# Altium schematic sheet IIC.SchDoc
size A4; SheetNumber: 7
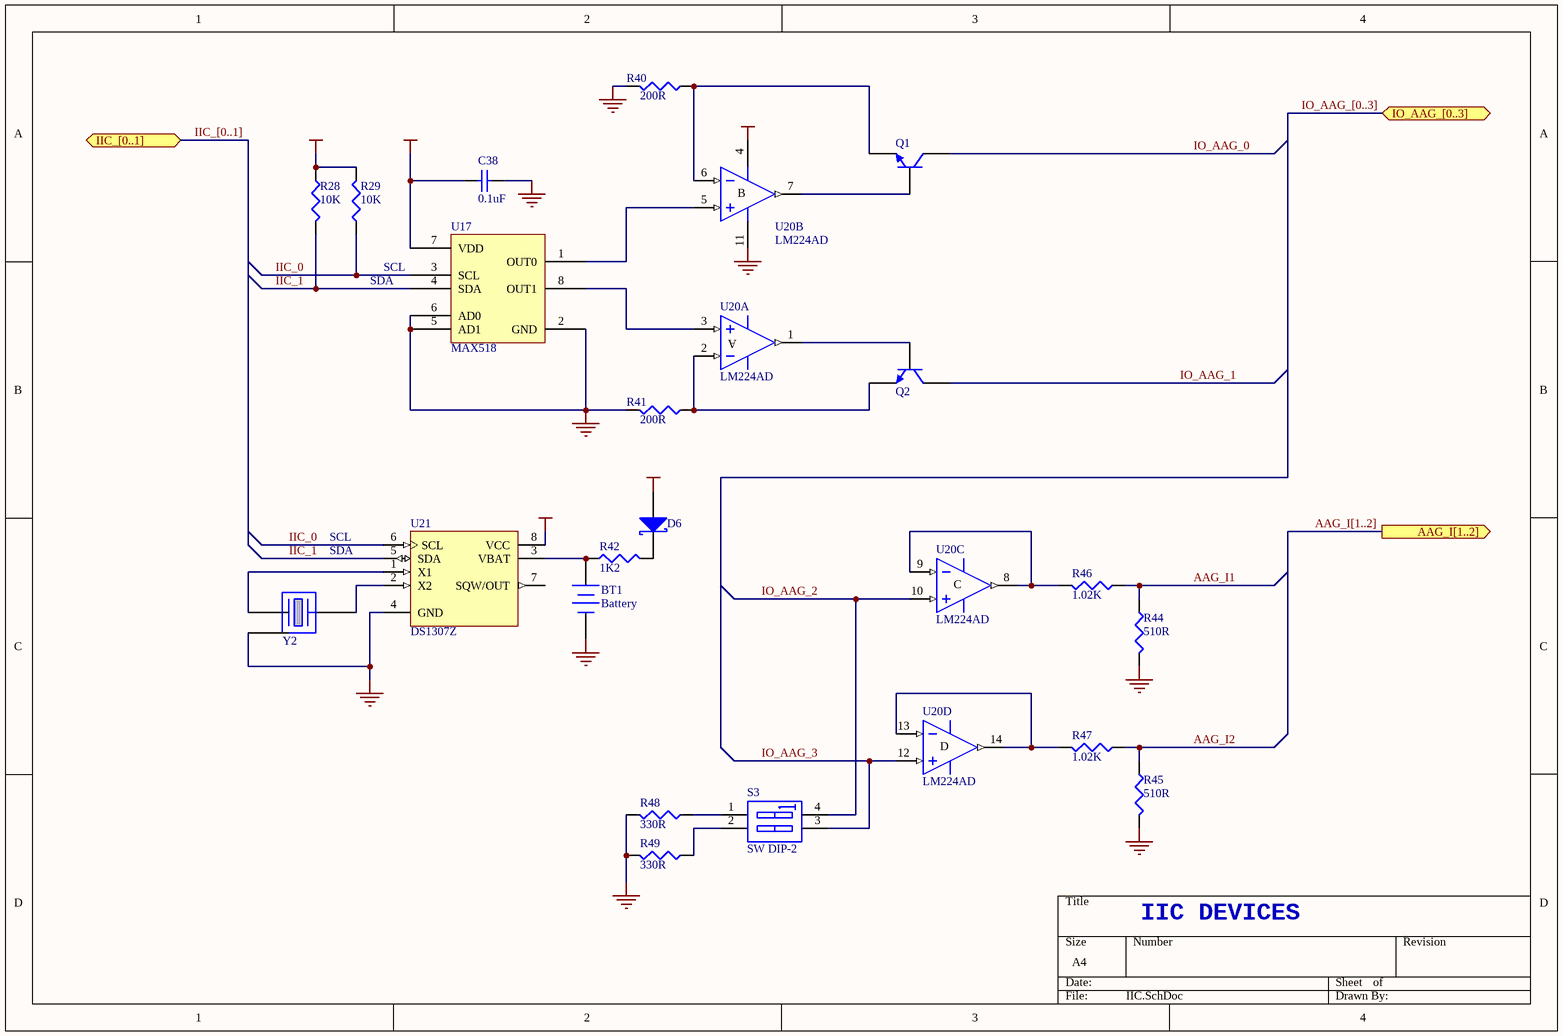
[diagram p0: IIC.SchDoc]

## Parts
BT1  Battery  [LITHIUM_BAT]
C38  value 0.1uF  [_0805]  (hidden comment: Cap Semi)
D6  Diode BAS70  [SO-G3/C2.5]  (value not drawn)
Q1  QNPN  [SO-G3/C2.5]  (value not drawn)
Q2  QNPN  [SO-G3/C2.5]  (value not drawn)
R28  value 10K  [_0805]  (hidden comment: Res3)
R29  value 10K  [_0805]  (hidden comment: Res3)
R40  value 200R  [_1206]  (hidden comment: Res3)
R41  value 200R  [_1206]  (hidden comment: Res3)
R42  value 1K2  [_0805]  (hidden comment: Res3)
R44  value 510R  [_0805]  (hidden comment: Res3)
R45  value 510R  [_0805]  (hidden comment: Res3)
R46  value 1.02K  [_0805]  (hidden comment: Res3)
R47  value 1.02K  [_0805]  (hidden comment: Res3)
R48  value 330R  [_0805]  (hidden comment: Res3)
R49  value 330R  [_0805]  (hidden comment: Res3)
S3  SW DIP-2  [SWITCH_2SPST]
U17  MAX518  [SO-G8/D5]
U20  LM224AD  [SO14B]  (parts A,B,C,D of 4)
U21  DS1307Z  [SOIC8N]
Y2  CRISTAL_SMD  [XTAL_32KHZ]  (value not drawn)

## Ports
AAG_I[1..2] (out), IIC_[0..1] (bidir), IO_AAG_[0..3] (bidir)

## Nets
GND: BT1.2(-) C38.2 R40.2 R41.2 R44.1 R45.1 R48.1 R49.1 U17.2(GND) U17.5(AD1) U17.6(AD0) U20.11(V-) U21.4(GND) Y2.0
VCC_3V: D6.1(A) R28.1 R29.2
VCC_5V: C38.1 U17.7(VDD) U21.8(VCC)
VCC_IN: U20.4(V+)
AAG_I1: R44.2 R46.2
AAG_I2: R45.2 R47.2
IIC_0: R29.1 U17.3(SCL) U21.6(SCL)
IIC_1: R28.2 U17.4(SDA) U21.5(SDA)
IO_AAG_0: Q1.3(C)
IO_AAG_1: Q2.3(C)
IO_AAG_2: S3.4(B1) U20.10(IN+)
IO_AAG_3: S3.3(B2) U20.12(IN+)
NetBT1_1: BT1.1(+) R42.1 U21.3(VBAT)
NetD6_3: D6.3(K) R42.2
NetQ1_1: Q1.1(B) U20.7(OUT)
NetQ1_2: Q1.2(E) R40.1 U20.6(IN-)
NetQ2_1: Q2.1(B) U20.1(OUT)
NetQ2_2: Q2.2(E) R41.1 U20.2(IN-)
NetR46_1: R46.1 U20.8(OUT) U20.9(IN-)
NetR47_1: R47.1 U20.13(IN-) U20.14(OUT)
NetR48_2: R48.2 S3.1(A1)
NetR49_2: R49.2 S3.2(A2)
NetU17_1: U17.1(OUT0) U20.5(IN+)
NetU17_8: U17.8(OUT1) U20.3(IN+)
NetU21_1: U21.1(X1) Y2.2
NetU21_2: U21.2(X2) Y2.1

Not connected (* = marked no-connect by the designer): U21 7(SQW/OUT)

## Buses and harness runs
bus AAG_I[1..2] = port AAG_I[1..2]
bus IIC_[0..1] = port IIC_[0..1]
bus IO_AAG_[0..3] = port IO_AAG_[0..3]

## Notes on the sheet
- SDA
- SCL
- IIC DEVICES
- (in symbol LM324AD, part A) A
- (in symbol LM324AD, part B) B
- (in symbol LM324AD, part C) C
- (in symbol LM324AD, part D) D

## Library data of the parts
BT1 = Battery: Multicell Battery; Published: 24-Mar-1999; Revision: July-2002: Re-released for DXP Platform.; Publisher: Altium Limited
C38 = Cap Semi: Capacitor (Semiconductor SIM Model); Published: 8-Jun-2000; Revision: July-2002: Re-released for DXP Platform.; Publisher: Altium Limited
D6 = Diode BAS70: Silicon AF Schottky Diode for High-Speed Switching; Package Information: Latest Revision: Sep-2001; Note: Pin 2 is not connected and not drawn.; Published: 21-Mar-2003; Datasheet: Latest Revision: Oct-1999; Package Reference: SOT-23; Publisher: Altium Limited
Q1 Q2 = QNPN: NPN Bipolar Transistor; Code - JEDEC: SOT-23; Published: 8-Jun-2000; Revision: July-2002: Re-released for DXP Platform.; Publisher: Altium Limited
R28 R29 R40-R42 R44-R49 = Res3: Resistor; Published: 8-Jun-2000; Revision: July-2002: Re-released for DXP Platform.; Publisher: Altium Limited
S3 = SW DIP-2: DIP Switch; Published: 24-Mar-1999; Revision: July-2002: Re-released for DXP Platform.; Publisher: Altium Limited
U17 = MAX518: 2-Wire serial 8-bit DACs
U20 = LM324AD: Low-Power Quad Operational Amplifier; Package Information: Latest Revision: Sep-1998; Published: 24-Aug-2001; Revision: 17-Jul-2002: Re-released for DXP Platform.; Datasheet: Latest Revision: Nov-1997; Package Reference: SO14B; Publisher: Altium Limited
U21 = DS1307Z: 64 X 8 Serial Real-Time Clock; Package Information: Latest Revision: 1999; Published: 13-Oct-2000; Revision: 17-Jul-2002: Re-released for DXP Platform.; Datasheet: Latest Revision: 10-Aug-1999; Package Reference: SOIC8N; Publisher: Altium Limited